# Altium schematic sheet charge_pump.SchDoc
size 420 x 297 mm; Address1: Address1; Address2: Address2; Address3: Address3; Address4: Address4; DocumentNumber: АБВГ.123456.001 Э3; SheetNumber: 4; SheetTotal: 7; Scale: 1:1; DocumentType: Схема электрическая принципиальная; FirstReferrence: АБВГ.123456.001
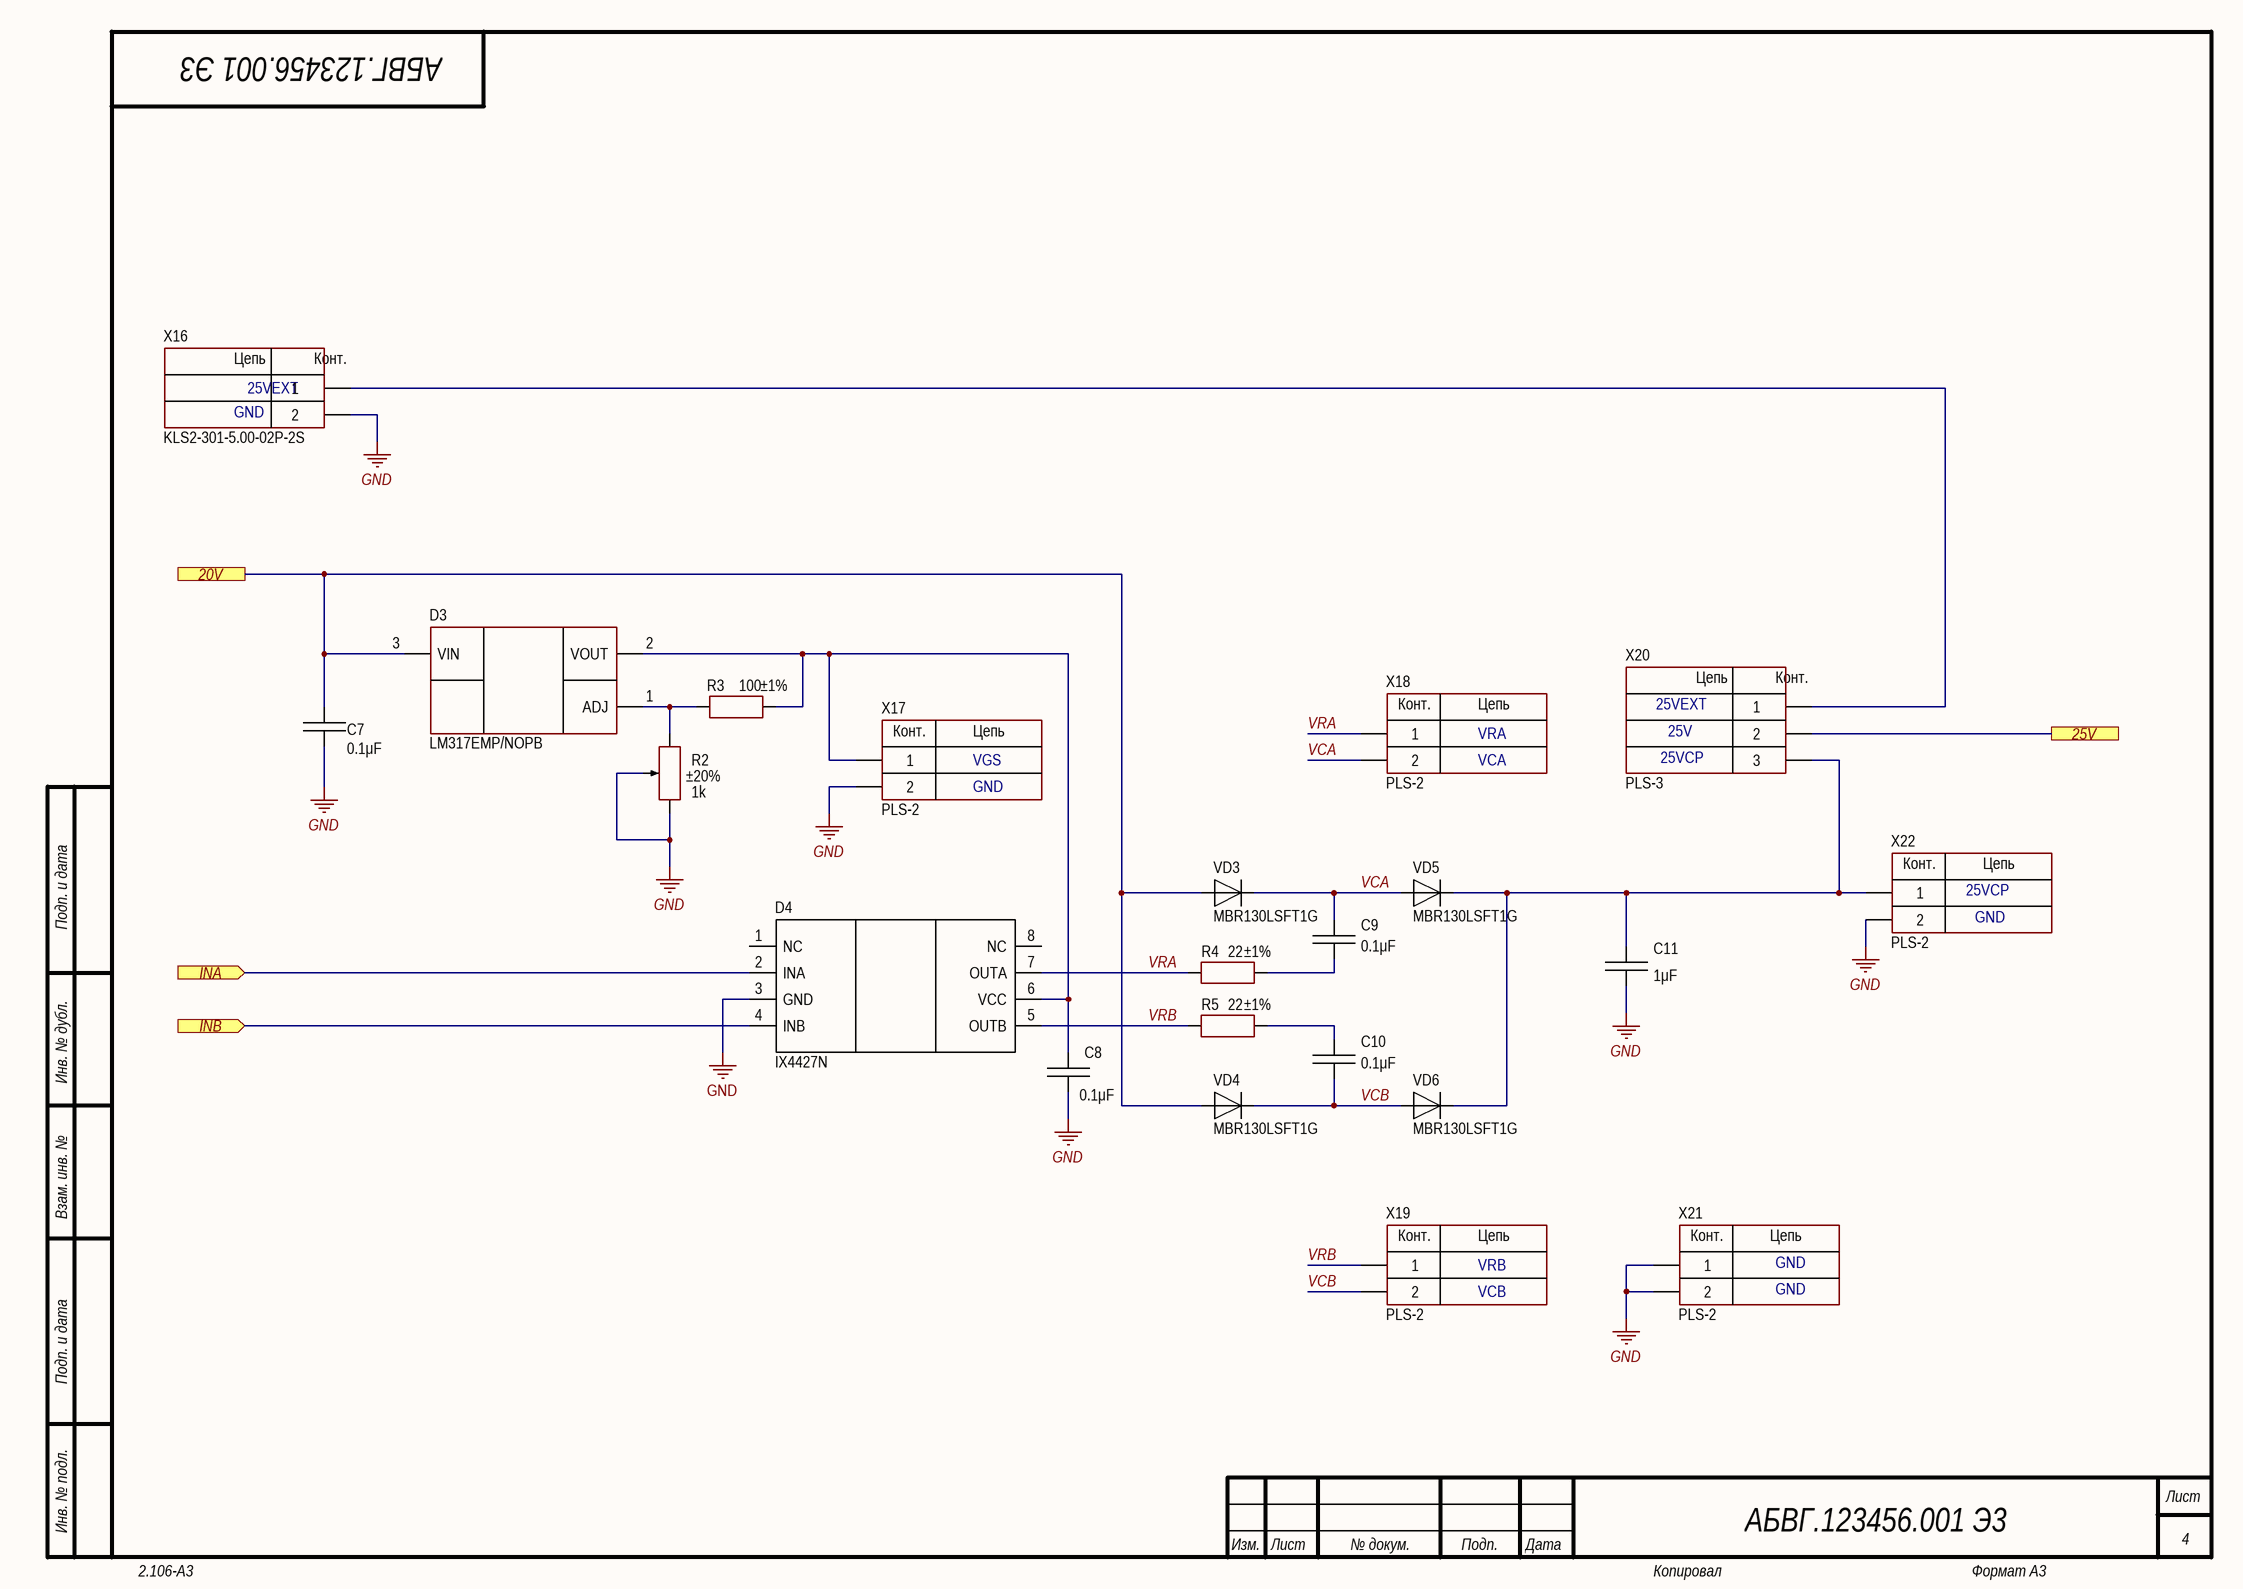
[diagram p0: charge_pump.SchDoc]

## Parts
C7  value 0.1μF  [CAP: 1206]
C8  value 0.1μF  [CAP: 1206]
C9  value 0.1μF  [CAP: 1206]
C10  value 0.1μF  [CAP: 1206]
C11  value 1μF  [CAP: 1206]
D3  PartNumber: LM317EMP/NOPB  [SOT223]  (hidden comment: *)
D4  Ixys Corporation  [8-SOIC]  (value not drawn)
R2  value 1k  Tolerance: ±20%  [RES: 3314G]
R3  value 100  Tolerance: ±1%  [RES: 1206]
R4  value 22  Tolerance: ±1%  [RES: 1206]
R5  value 22  Tolerance: ±1%  [RES: 1206]
VD3  PartNumber: MBR130LSFT1G  [DIODE: SOD123F]
VD4  PartNumber: MBR130LSFT1G  [DIODE: SOD123F]
VD5  PartNumber: MBR130LSFT1G  [DIODE: SOD123F]
VD6  PartNumber: MBR130LSFT1G  [DIODE: SOD123F]
X16  CommentText: KLS2-301-5.00-02P-2S  [CON: Terminal 2p 5mm]
X17  (no value)  [CON: PLS-2]
X18  (no value)  [CON: PLS-2]
X19  (no value)  [CON: PLS-2]
X20  (no value)  [CON: PLS-3]
X21  (no value)  [CON: PLS-2]
X22  (no value)  [CON: PLS-2]

## Ports
20V, 25V, INA (in), INB (in)

## Nets
GND: C7.1 C8.1 C11.1 D4.3(GND) R2.1 R2.2 X16.2 X17.2 X21.1 X21.2 X22.2
20V: C7.2 D3.3(VIN) VD3.1 VD4.1 ; port 20V
25V: X20.2 ; port 25V
INA: D4.2(INA) ; port INA
INB: D4.4(INB) ; port INB
VCA: C9.2 VD3.2 VD5.1 X18.2
VCB: C10.1 VD4.2 VD6.1 X19.2
VRA: D4.7(OUTA) R4.2 X18.1
VRB: D4.5(OUTB) R5.2 X19.1
NetC8_2: C8.2 D3.2(VOUT) D4.6(VCC) R3.1 X17.1
NetC9_1: C9.1 R4.1
NetC10_2: C10.2 R5.1
NetC11_2: C11.2 VD5.2 VD6.2 X20.3 X22.1
NetD3_1: D3.1(ADJ) R2.3 R3.2
NetX16_1: X16.1 X20.1

Not connected (* = marked no-connect by the designer): D4 1(NC) 8(NC)

## Notes on the sheet
- 25VEXT
- GND
- VGS
- VCA
- VRA
- 25VCP
- 25V
- VRB
- VCB
- Подп. и дата
- Инв. № дубл.
- Взам. инв. №
- Инв. № подл.
- Изм.
- Лист
- № докум.
- Подп.
- Дата
- 2.106-A3
- Копировал
- Формат А3
- (in symbol PLS-2) Конт.; Цепь
- (in symbol PLS-3) Цепь; Конт.
- (in symbol Terminal block 2) Цепь; Конт.

## Library data of the parts
C7-C10 = Ceramic_1206: Manufacturer: Murata Electronics; PartNumber: GRM319R71H104K; ValueManufacturerPartNumber: Ceramic capacitor, 0.1μF, X7R, ±10%, 50V, 1206, -55...+125°C; TypeCapacitor: Ceramic capacitor; Tolerance: ±10%; TypeDielectric: X7R; Voltage: 50V; Package: 1206; HelpURL: https://www.chipdip.ru/product/grm319r71h104k; Temperature: -55...+125°C
C11 = Ceramic_1206: Manufacturer: Murata Electronics; PartNumber: GRM31MR71E105K; ValueManufacturerPartNumber: Ceramic capacitor, 1μF, X7R, ±10%, 50V, 1206, -55...+125°C; TypeCapacitor: Ceramic capacitor; Tolerance: ±10%; TypeDielectric: X7R; Voltage: 50V; Package: 1206; HelpURL: https://www.chipdip.ru/product/grm31mr71e105k; Temperature: -55...+125°C
D3 = AMS1117-5.0: Three-Pin Adjustable Regulator; Manufacturer: Texas Instruments; HelpURL: https://www.chipdip.ru/product/lm317emp-nopb; Package: SOT223; ComponentType: Three-Pin Adjustable Regulator; ValueManufacturerPartNumber: *; Temperature: *; VoltageInput: *; MaxDropout: *; CurrentOutput: *; VoltageOutput: *
D4 = IX4427N: Gate driver; Manufacturer: Ixys Corporation; HelpURL: https://www.chipdip.ru/product/ix4427n; Package: SOIC-8; ComponentType: Gate driver; PartNumber: IX4427N
R2 = Trimmer: Manufacturer: Bourns; PartNumber: 3314G-1-103E; Power: 0.25W; Package: 3314G; HelpURL: https://www.chipdip.ru/product/3314g-1-103e; ValueManufacturerPartNumber: =TypeResistor+', '+Value+', '+Tolerance+', '+Package+', '+Power+', '+Temperature; Temperature: -55...+125°C
R3 = Resistor_1206: Manufacturer: Yageo; PartNumber: RC1206JR-07100RL; ValueManufacturerPartNumber: Resistor film, 100, ±1%, 1206, 0.25W, -55...+125°C; TypeResistor: Resistor film; Power: 0.25W; Package: 1206; HelpURL: https://www.chipdip.ru/product0/9000079905; Temperature: -55...+125°C
R4 R5 = Resistor_1206: Manufacturer: Yageo; PartNumber: RC1206JR-07100RL; ValueManufacturerPartNumber: Resistor film, 22, ±1%, 1206, 0.25W, -55...+125°C; TypeResistor: Resistor film; Power: 0.25W; Package: 1206; HelpURL: https://www.chipdip.ru/product0/9000079905; Temperature: -55...+125°C
VD3-VD6 = Diode_single: Manufacturer: ON Semiconductor; TypeDiode: Single diode; Voltage: 30V; Current: 1A; VoltageDrop: 380mV; Package: SOD-123FL; HelpURL: https://www.chipdip.ru/product/mbr130lsft1g; ValueManufacturerPartNumber: =TypeDiode+', '+Voltage+', '+Current+', '+VoltageDrop+', '+RecoveryTime+', '+Package+', '+Temperature; Temperature: -55…+125 C
X16 = Terminal block 2: ValueManufacturerPartNumber: Connector, 2pin, *, *, *; TypeConnector: Connector; Multichannel: 2pin; Manufacturer: *; HelpURL: *; PartNumber: KLS2-301-5.00-02P-2S; VoltageMax: *; Pitch: *; CurrentMax: *
X17-X19 X21 X22 = PLS-2: Manufacturer: Connfly; ValueManufacturerPartNumber: Connector, 2pin, 2.54mm, 500VAC, 3A; TypeConnector: Connector; VoltageMax: 500VAC; Pitch: 2.54mm; CurrentMax: 3A; Multichannel: 2pin; HelpURL: https://www.chipdip.ru/product/pls-2; PartNumber: PLS-2; CommentText: PLS-2
X20 = PLS-3: Manufacturer: Connfly; ValueManufacturerPartNumber: Connector, 3pin, 2.54mm, 500VAC, 3A; TypeConnector: Connector; VoltageMax: 500VAC; Pitch: 2.54mm; CurrentMax: 3A; Multichannel: 3pin; HelpURL: https://www.chipdip.ru/product/pls-3; PartNumber: PLS-3; CommentText: PLS-3